# Altium schematic sheet 7Seg LED Display Driver.SchDoc
size A4
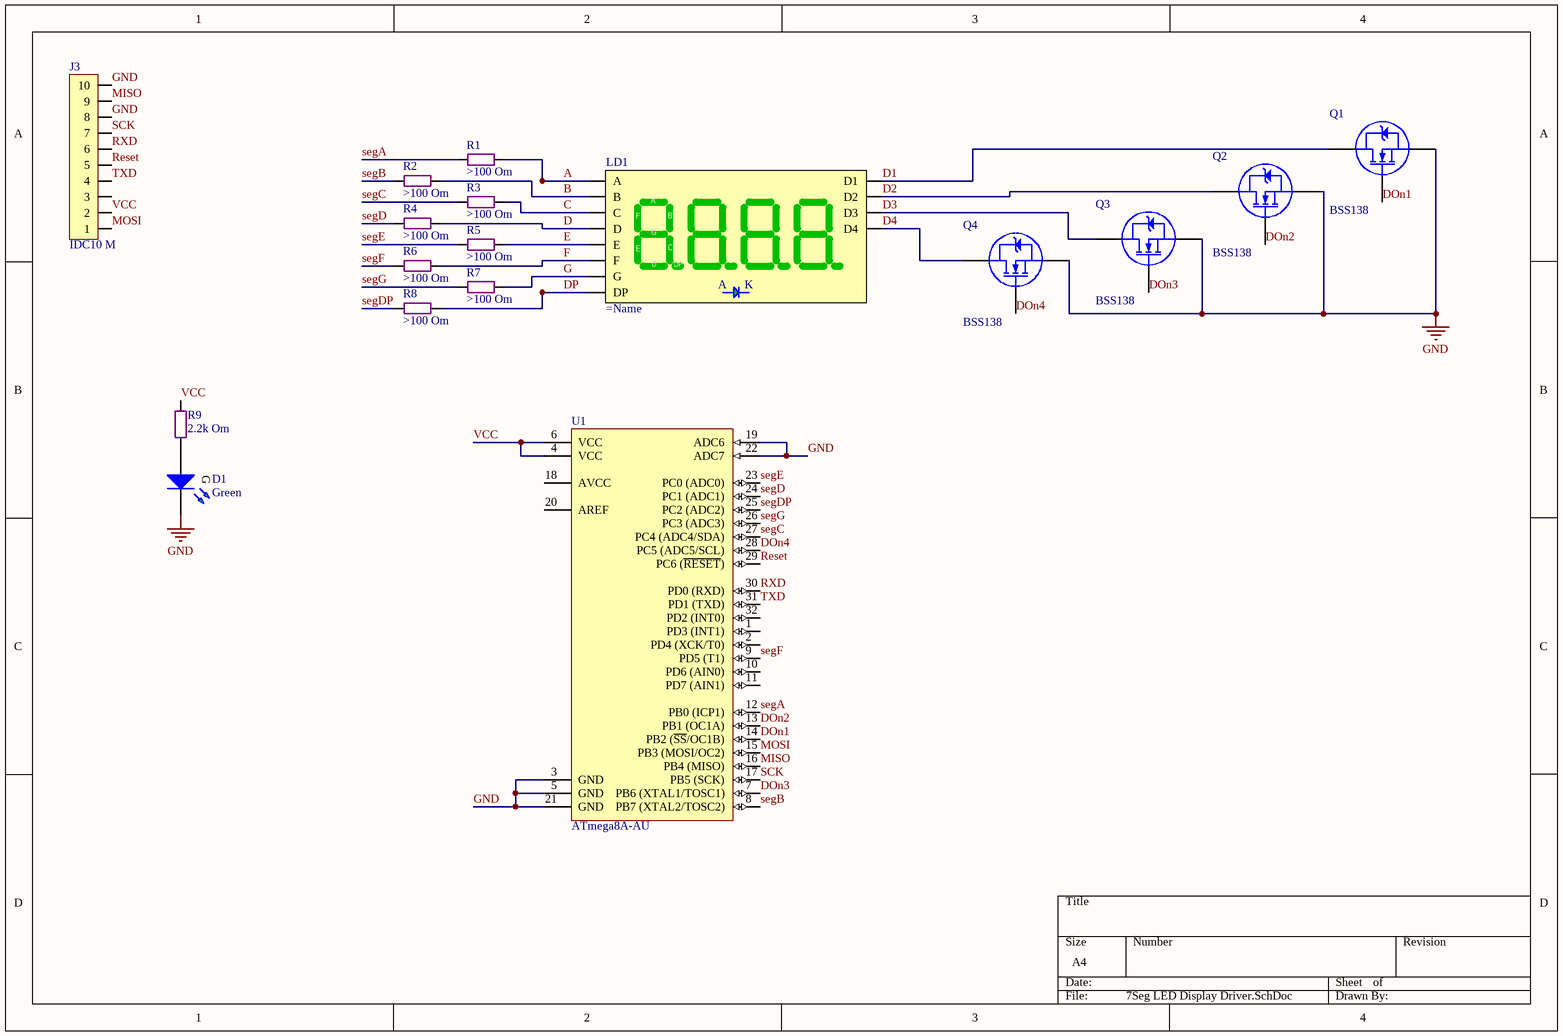
[diagram p0: 7Seg LED Display Driver.SchDoc]

## Parts
D1  Green  [LED SMD 0805 Green]
J3  IDC10 M  [LINE 2.54 x 10D (2 x 5) - BH]
LD1  (no value)  [7 seg, Dyn, 4 Digit]
Q1  BSS138  [SOT-23]
Q2  BSS138  [SOT-23]
Q3  BSS138  [SOT-23]
Q4  BSS138  [SOT-23]
R1  >100 Om  [SMD 0805 (2012)]
R2  >100 Om  [SMD 0805 (2012)]
R3  >100 Om  [SMD 0805 (2012)]
R4  >100 Om  [SMD 0805 (2012)]
R5  >100 Om  [SMD 0805 (2012)]
R6  >100 Om  [SMD 0805 (2012)]
R7  >100 Om  [SMD 0805 (2012)]
R8  >100 Om  [SMD 0805 (2012)]
R9  2.2k Om  [SMD 0805 (2012)]
U1  ATmega8A-AU  [32A_N]

## Nets
GND: D1.K J3.8 J3.10 Q1.3(S) Q2.3(S) Q3.3(S) Q4.3(S) U1.3(GND) U1.5(GND) U1.19(ADC6) U1.21(GND) U1.22(ADC7)
A: LD1.A R1.2
B: LD1.B R2.2
C: LD1.C R3.2
D: LD1.D R4.2
D1: LD1.D1 Q1.2(D)
D2: LD1.D2 Q2.2(D)
D3: LD1.D3 Q3.2(D)
D4: LD1.D4 Q4.2(D)
DOn1: Q1.1(G) U1.14(PB2_(~{SS}/OC1B))
DOn2: Q2.1(G) U1.13(PB1_(OC1A))
DOn3: Q3.1(G) U1.7(PB6_(XTAL1/TOSC1))
DOn4: Q4.1(G) U1.28(PC5_(ADC5/SCL))
DP: LD1.DP R8.2
E: LD1.E R5.2
F: LD1.F R6.2
G: LD1.G R7.2
MISO: J3.9 U1.16(PB4_(MISO))
MOSI: J3.1 U1.15(PB3_(MOSI/OC2))
Reset: J3.5 U1.29(PC6_(~{RESET}))
RXD: J3.6 U1.30(PD0_(RXD))
SCK: J3.7 U1.17(PB5_(SCK))
segA: R1.1 U1.12(PB0_(ICP1))
segB: R2.1 U1.8(PB7_(XTAL2/TOSC2))
segC: R3.1 U1.27(PC4_(ADC4/SDA))
segD: R4.1 U1.24(PC1_(ADC1))
segDP: R8.1 U1.25(PC2_(ADC2))
segE: R5.1 U1.23(PC0_(ADC0))
segF: R6.1 U1.9(PD5_(T1))
segG: R7.1 U1.26(PC3_(ADC3))
TXD: J3.4 U1.31(PD1_(TXD))
VCC: J3.2 R9.1 U1.4(VCC) U1.6(VCC)
NetD1_A: D1.A R9.2

Not connected (* = marked no-connect by the designer): J3 3; U1 1(PD3_(INT1)) 2(PD4_(XCK/T0)) 10(PD6_(AIN0)) 11(PD7_(AIN1)) 18(AVCC) 20(AREF) 32(PD2_(INT0))

## Notes on the sheet
- (in symbol 7 Seg, 4 dig, Dynamic) K
- (in symbol Led SMD 0805 Green) G

## Library data of the parts
D1 = Led SMD 0805 Green: ?2v ?20mA; Forward Voltage TYP: ?2; Resistor for 5v VCC: 330 Om; Forward Voltage Min: ?; Wave len min/typ: ?; Liminous Min (mcd): ?; Liminous Typ (mcd): ?; Forward Amp (mA): ?; Color: Green
J3 = PLD-10 (2 x 5): Vert, Dbl line, Male
LD1 = 7 Seg, 4 dig, Dynamic: Dynamic Common Catode/Anode 4 Digits Display
Q1-Q4 = BSS138: N-Channel 50V - 0.7-1Ω - 0.22A; Monufacturer: Farchild; V DSS (v): 60; RDS: <6Om; I d - Drain current (continuous) at TC = 100°C: 50 A; I d - Drain current (continuous) at TC = 25°C: 0.22 A; Name: BSS138; Datasheet: http://tec.org.ru/board/0-0-0-511-20
R1-R9 = Res All Types
U1 = ATmega8A-AU: 8-bit AVR Microcontroller, 8KB Flash, 512 Bytes EEPROM, 1KB SRAM, 32-pin TQFP, Industrial Grade (-40°C to 85°C); Published: 1-Apr-2010; DatasheetVersion: revC, Jul-2009; PackageVersion: revB, Oct-2001; PackageReference: 32A; Publisher: Altium Limited; PackageDescription: 32-Lead, 7x7x1.0 mm Body, 0.8mm Lead Pitch, Thin Profile Plastic Quad Flat Package (TQFP); Supplier 1: Digi-Key; Supplier Part Number 1: ATMEGA8A-AU-ND; Supplier 2: Farnell; Supplier Part Number 2: 1748532; Supplier 3: Mouser; Supplier Part Number 3: 556-ATMEGA8A-AU; Code_JEDEC: MS-026-ABA; ComponentLink1Description: Manufacturer Link; ComponentLink1URL: http://www.atmel.com/products/avr/default.asp?; ComponentLink2Description: ATmega8A Datasheet; ComponentLink2URL: http://www.atmel.com/dyn/resources/prod_documents/doc8159.pdf; ComponentLink3Description: ATmega8A Summary; ComponentLink3URL: http://www.atmel.com/dyn/resources/prod_documents/8159S.pdf; ComponentLink4Description: Atmel.com Home; ComponentLink4URL: http://www.atmel.com